# Altium project LL_project.PrjPcb
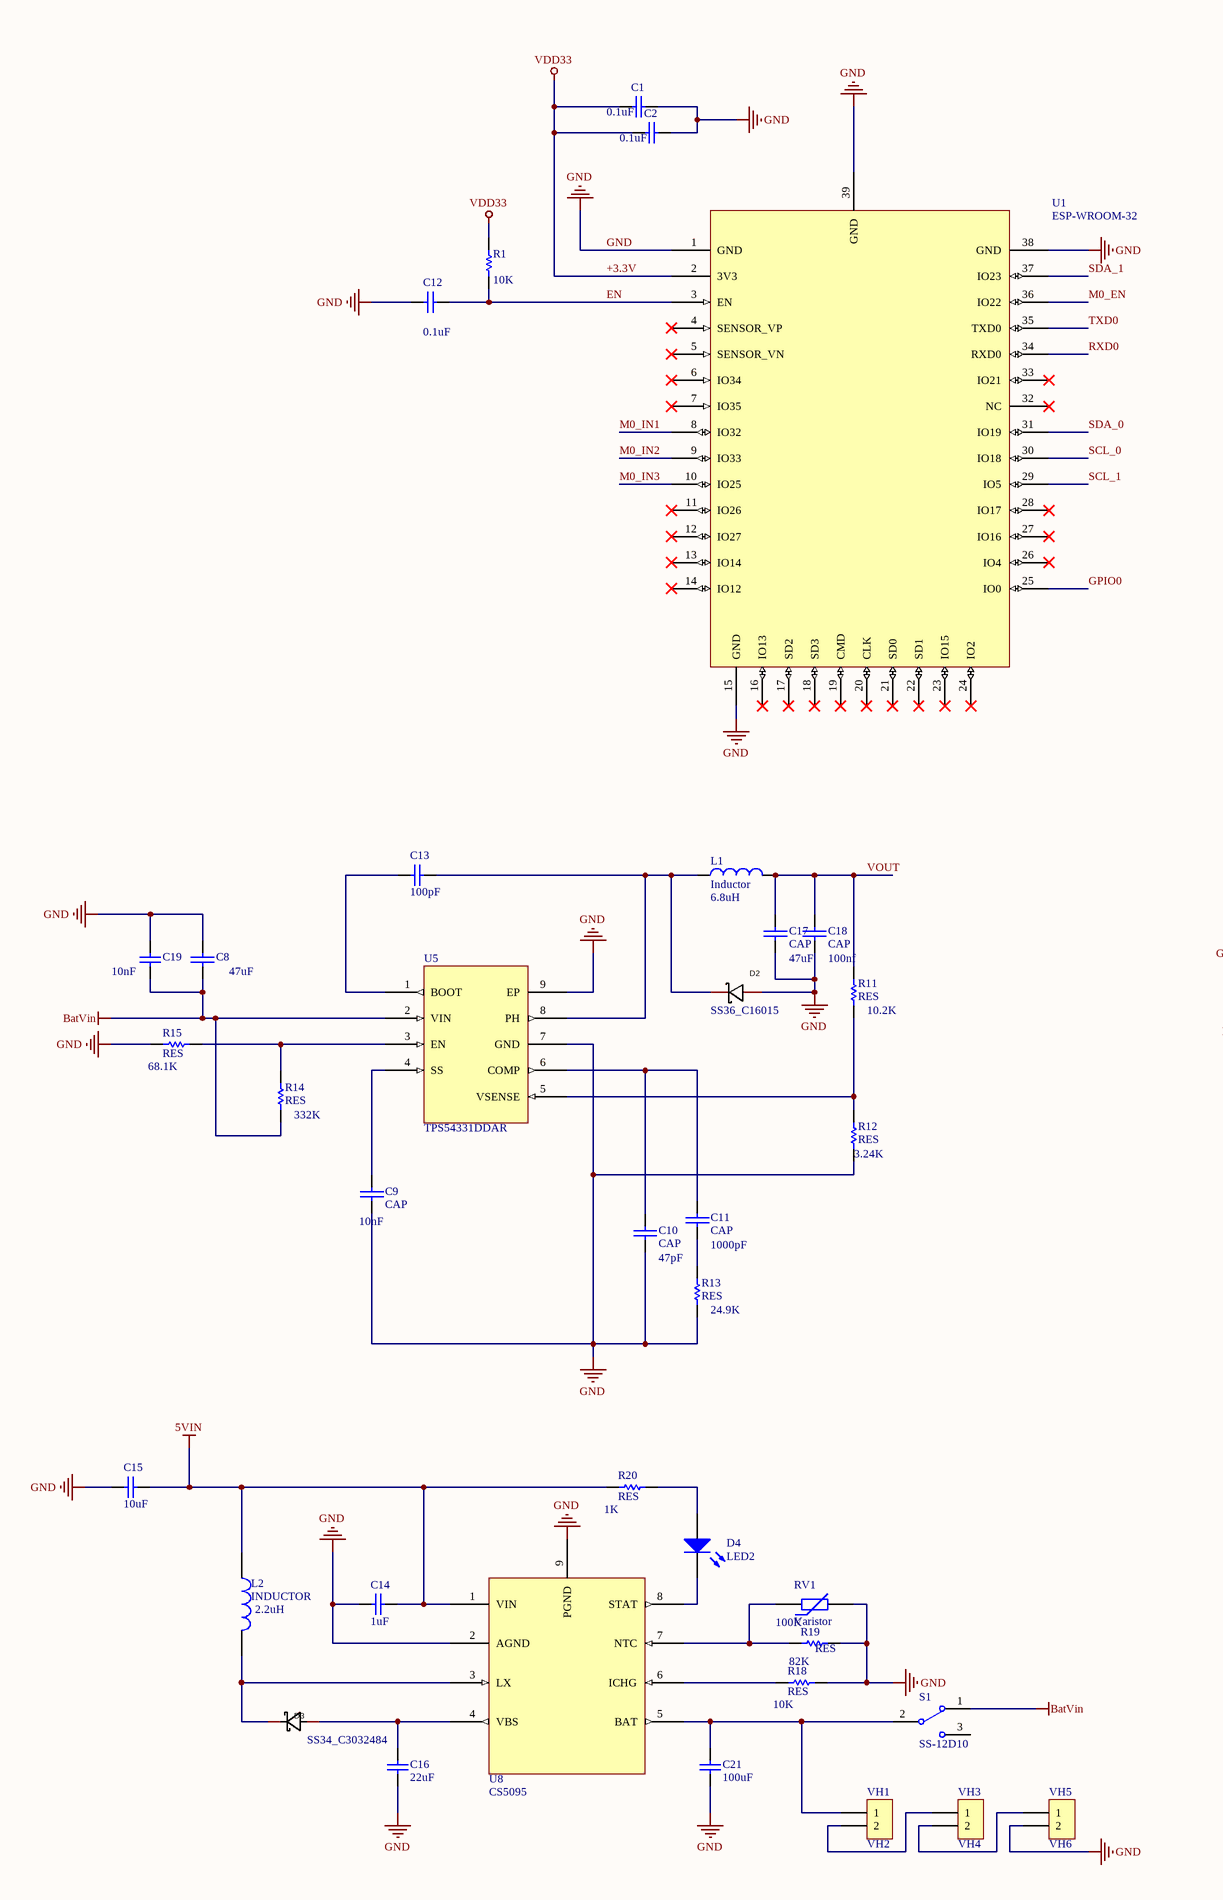
[diagram p0: LL_project.SchDoc, left]
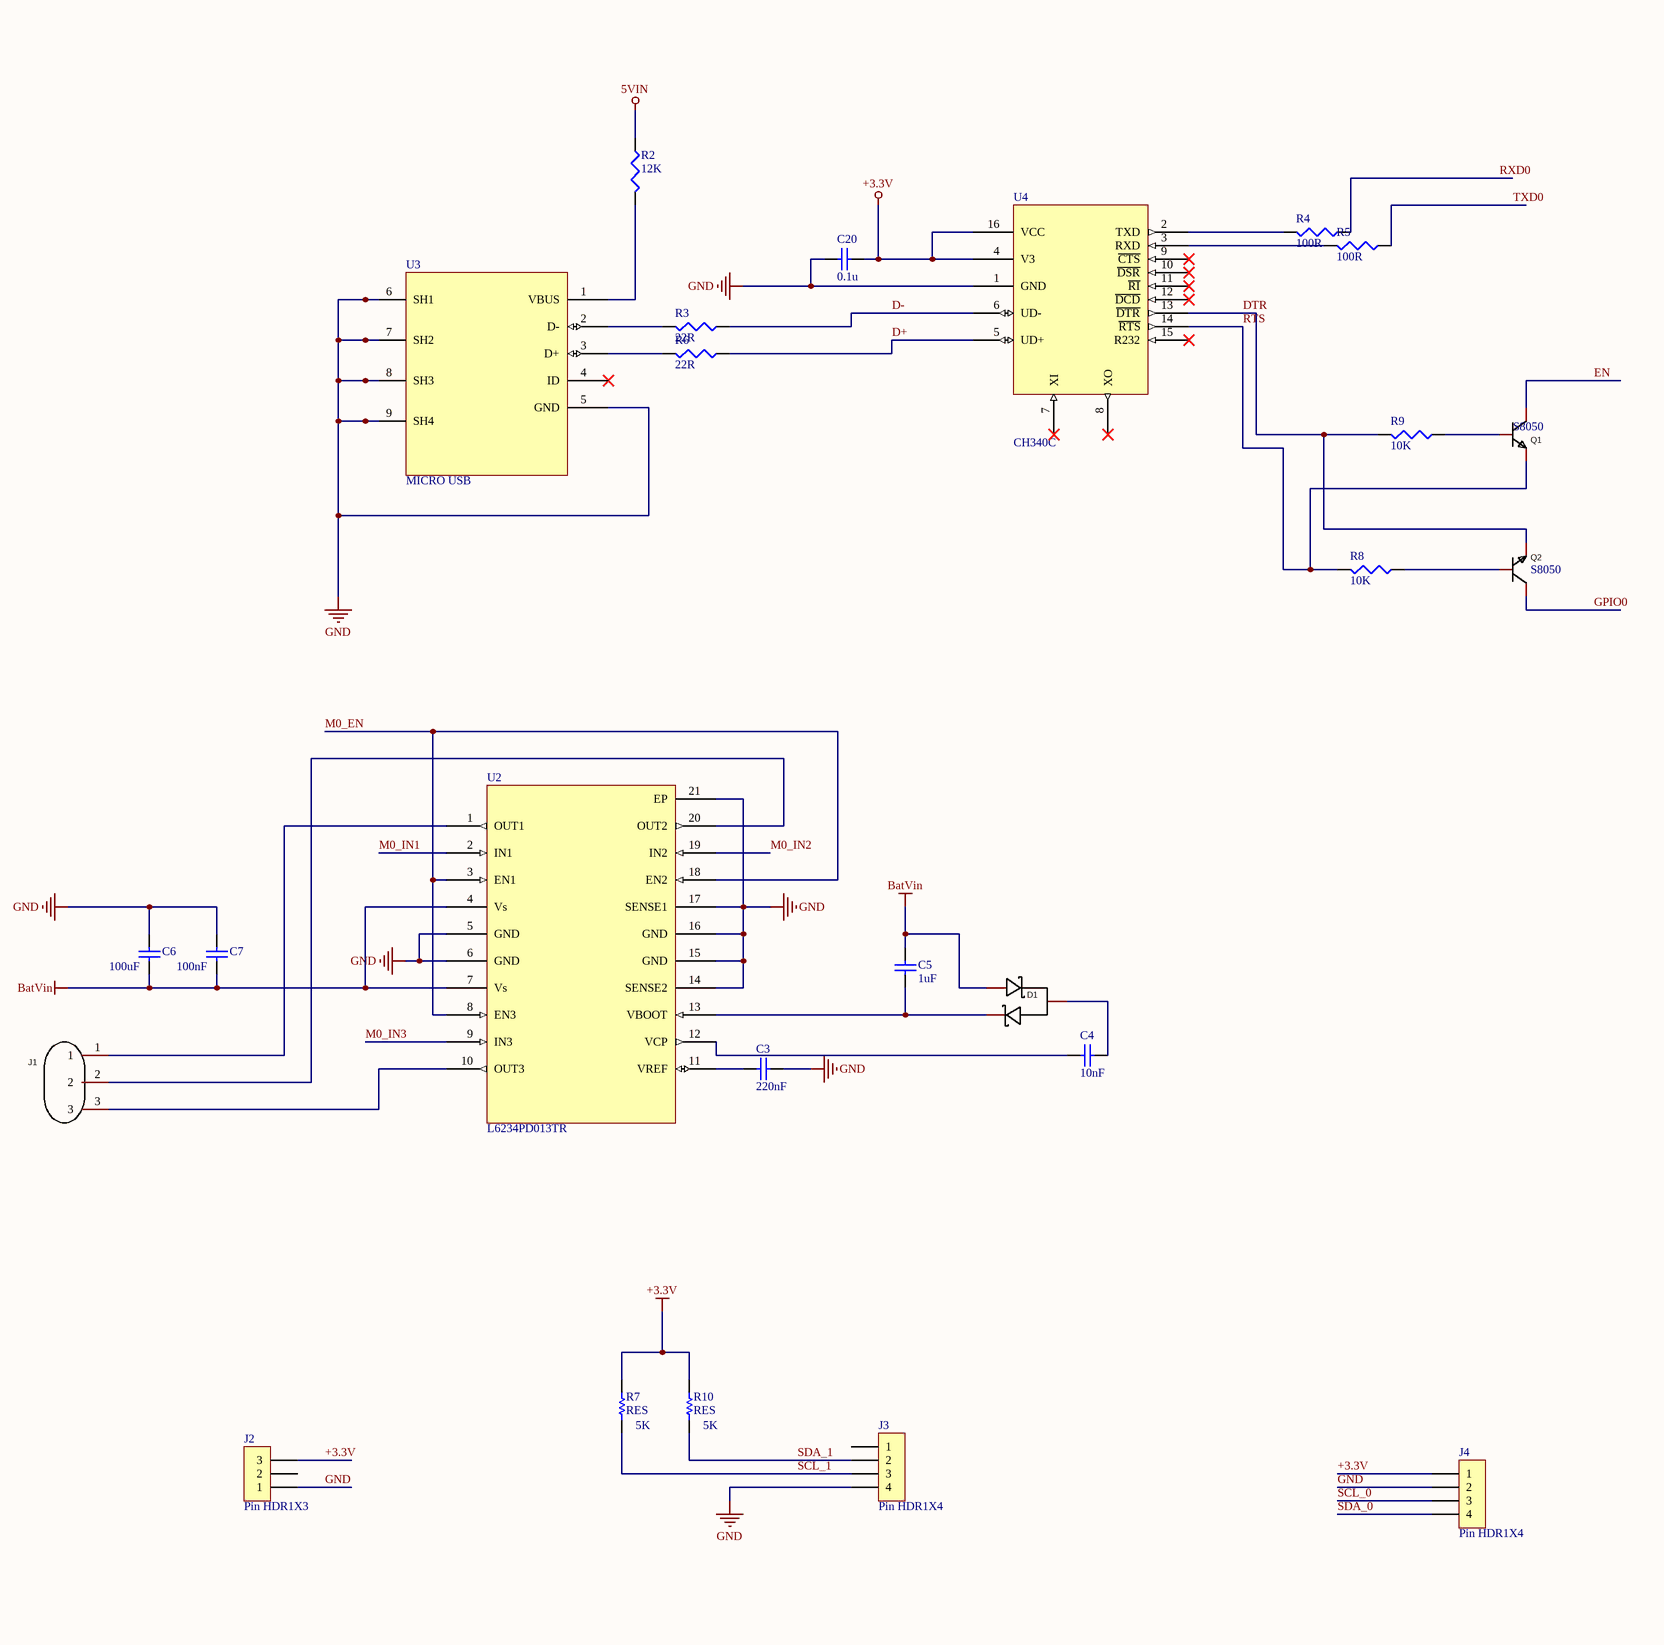
[diagram p1: LL_project.SchDoc, right]
1 sheet, 62 parts. Net scope: global (net labels, ports and power ports of the same name join across sheets).
Board file: LL_project.PcbDoc

## Sheet LL_project.SchDoc
size A2

### Parts
C1  value 0.1uF  [0603-1]  (hidden comment: Cap Semi)
C2  value 0.1uF  [0603-1]  (hidden comment: Cap Semi)
C3  value 220nF  [0603-1]  (hidden comment: Cap Semi)
C4  value 10nF  [0603-1]  (hidden comment: Cap Semi)
C5  value 1uF  [0603-1]  (hidden comment: Cap Semi)
C6  value 100uF  [0603-1]  (hidden comment: Cap Semi)
C7  value 100nF  [0603-1]  (hidden comment: Cap Semi)
C8  CAP  [0603-1]  (value not drawn)
C9  CAP  [0603-1]
C10  CAP  [0603-1]
C11  CAP  [0603-1]
C12  value 0.1uF  [0603-1]  (hidden comment: Cap Semi)
C13  value 100pF  [0603-1]  (hidden comment: Cap Semi)
C14  value 1uF  [0603-1]  (hidden comment: Cap Semi)
C15  value 10uF  [0603-1]  (hidden comment: Cap Semi)
C16  value 22uF  [0603-1]  (hidden comment: Cap Semi)
C17  CAP  [0603-1]
C18  CAP  [0603-1]
C19  value 10nF  [0603-1]  (hidden comment: Cap Semi)
C20  value 0.1u  [0603-1]  (hidden comment: Cap Semi)
C21  value 100uF  [0603-1]  (hidden comment: Cap Semi)
D1  LBAT54SLT1G  [schottky]  (value not drawn)
D2  SS36_C16015  [SMA_L4.3-W2.6-LS5.2-RD]
D3  SS34_C3032484  [SMA_L4.3-W2.6-LS5.2-RD]
D4  LED2  [LED_0603_R]
J1  WJ126V-5.0-3P  [CONN-TH_3P-P5.00_WJ126V-5.0-3P]  (value not drawn)
J2  Pin HDR1X3  [Pin HDR1X3/2.54mm-S]
J3  Pin HDR1X4  [Pin HDR1X4/2.54mm-S]
J4  Pin HDR1X4  [Pin HDR1X4/2.54mm-S]
L1  Inductor  value 6.8uH  [0805L]
L2  INDUCTOR  [0603L]
Q1  S8050  [Q1]
Q2  S8050  [Q1]
R1  value 10K  [0603-1]  (hidden comment: Res1)
R2  value 12K  [0805-1]  (hidden comment: Res3)
R3  value 22R  [0603-1]  (hidden comment: Res3)
R4  value 100R  [0603-1]  (hidden comment: Res3)
R5  value 100R  [0603-1]  (hidden comment: Res3)
R6  value 22R  [0603-1]  (hidden comment: Res3)
R7  RES  [0603-1]
R8  value 10K  [0603-1]  (hidden comment: Res3)
R9  value 10K  [0603-1]  (hidden comment: Res3)
R10  RES  [0603-1]
R11  RES  [0603-1]
R12  RES  [0603-1]
R13  RES  [0603-1]
R14  RES  [0603-1]
R15  RES  [0603-1]
R18  RES  [0603-1]
R19  RES  [0603-1]
R20  RES  [0603-1]
RV1  Varistor  [0603-1]
S1  SS-12D10  [SS-12D10]
U1  ESP-WROOM-32  [ESP32]
U2  L6234PD013TR  [L6234]
U3  MICRO USB  [MICRO-USB-SMD_MICROXNJ]
U4  CH340C  [SOP-16_L10.0-W3.9-P1.27-LS6.0-BL]
U5  TPS54331DDAR  [SOIC-8_L5.0-W4.0-P1.27-LS6.0-BL-EP2.0]
U8  CS5095  [cs5095]
VH1  VH2  [VH]
VH3  VH4  [VH]
VH5  VH6  [VH]

### Nets
5VIN: C14.2 C15.2 L2.1 R2.1 R20.2 U8.1(VIN)
+3.3V: C1.1 C2.1 C20.1 J2.3 J4.1 R1.2 R7.2 R10.2 U1.2(3V3) U4.4(V3) U4.16(VCC)  [also labelled VDD33]
BatVin: C5.1 C6.1 C7.1 C8.1 C19.1 D1.1(A) R14.1 S1.1 U2.4(Vs) U2.7(Vs) U5.2(VIN)
GND: C1.2 C2.2 C3.1 C6.2 C7.2 C8.2 C9.1 C10.1 C12.1 C14.1 C15.1 C16.1 C17.1 C18.1 C19.2 C20.2 C21.1 D2.2(A) J2.1 J3.4 J4.2 R12.1 R13.1 R15.2 R18.1 R19.1 RV1.2 U1.1(GND) U1.15(GND) U1.38(GND) U1.39(GND) U2.5(GND) U2.6(GND) U2.14(SENSE2) U2.15(GND) U2.16(GND) U2.17(SENSE1) U2.21(EP) U3.5(GND) U3.6(SH1) U3.7(SH2) U3.8(SH3) U3.9(SH4) U4.1(GND) U5.7(GND) U5.9(EP) U8.2(AGND) U8.9(PGND) VH5.2
D+: R6.1 U4.5(UD+)
D-: R3.1 U4.6(UD-)
DTR: Q2.2(E) R9.2 U4.13(~{DTR})
EN: C12.2 Q1.3(C) R1.1 U1.3(EN)
GPIO0: Q2.3(C) U1.25(IO0)
M0_EN: U1.36(IO22) U2.3(EN1) U2.8(EN3) U2.18(EN2)
M0_IN1: U1.8(IO32) U2.2(IN1)
M0_IN2: U1.9(IO33) U2.19(IN2)
M0_IN3: U1.10(IO25) U2.9(IN3)
RTS: Q1.2(E) R8.2 U4.14(~{RTS})
RXD0: R4.1 U1.34(RXD0)
SCL_0: J4.3 U1.30(IO18)
SCL_1: J3.3 R7.1 U1.29(IO5)
SDA_0: J4.4 U1.31(IO19)
SDA_1: J3.2 R10.1 U1.37(IO23)
TXD0: R5.1 U1.35(TXD0)
VOUT: C17.2 C18.2 L1.2 R11.2
NetC3_2: C3.2 U2.11(VREF)
NetC4_1: C4.1 D1.3(AK)
NetC4_2: C4.2 U2.12(VCP)
NetC5_2: C5.2 D1.2(K) U2.13(VBOOT)
NetC9_2: C9.2 U5.4(SS)
NetC10_2: C10.2 C11.2 U5.6(COMP)
NetC11_1: C11.1 R13.2
NetC13_1: C13.1 U5.1(BOOT)
NetC13_2: C13.2 D2.1(K) L1.1 U5.8(PH)
NetC16_2: C16.2 D3.2(A) U8.4(VBS)
NetC21_2: C21.2 S1.2 U8.5(BAT) VH1.1
NetD3_1: D3.1(K) L2.2 U8.3(LX)
NetD4_1: D4.1(A) R20.1
NetD4_2: D4.2(K) U8.8(STAT)
NetJ1_1: J1.1 U2.1(OUT1)
NetJ1_2: J1.2 U2.20(OUT2)
NetJ1_3: J1.3 U2.10(OUT3)
NetQ1_1: Q1.1(B) R9.1
NetQ2_1: Q2.1(B) R8.1
NetR2_2: R2.2 U3.1(VBUS)
NetR3_2: R3.2 U3.2(D-)
NetR4_2: R4.2 U4.2(TXD)
NetR5_2: R5.2 U4.3(RXD)
NetR6_2: R6.2 U3.3(D+)
NetR11_1: R11.1 R12.2 U5.5(VSENSE)
NetR14_2: R14.2 R15.1 U5.3(EN)
NetR18_2: R18.2 U8.6(ICHG)
NetR19_2: R19.2 RV1.1 U8.7(NTC)
NetVH1_2: VH1.2 VH3.1
NetVH3_2: VH3.2 VH5.1

Not connected (* = marked no-connect by the designer): J2 2; J3 1; S1 3; U1 4(SENSOR_VP)* 5(SENSOR_VN)* 6(IO34)* 7(IO35)* 11(IO26)* 12(IO27)* 13(IO14)* 14(IO12)* 16(IO13)* 17(SD2)* 18(SD3)* 19(CMD)* 20(CLK)* 21(SD0)* 22(SD1)* 23(IO15)* 24(IO2)* 26(IO4)* 27(IO16)* 28(IO17)* 32(NC)* 33(IO21)*; U3 4(ID)*; U4 7(XI)* 8(XO)* 9(~{CTS})* 10(~{DSR})* 11(~{RI})* 12(~{DCD})* 15(R232)*

### Notes on the sheet
- (in symbol CAP) 10nF; 47pF; 1000pF; 47uF; 100nf
- (in symbol INDUCTOR) 2.2uH
- (in symbol RES) 10.2K; 3.24K; 24.9K; 332K; 68.1K; 10K; 82K; 1K; 5K
- (in symbol Varistor) 100K

### Library data of the parts
C1-C7 C12-C16 C19-C21 = Cap Semi: Capacitor (Semiconductor SIM Model); Published: 8-Jun-2000; LatestRevisionDate: 29-May-2009; LatestRevisionNote: IPC-7351 Footprint Added.; PackageReference: C1206; Publisher: Altium Limited; PackageDescription: Chip Capacitor
C8-C11 C17 C18 = CAP: 无极性电容
D1 = LBAT54SLT1G: Manufacturer: LRC(乐山无线电); Add into BOM: yes; Reverse Voltage (Vr): 30V; Average Rectified Current (Io): 200mA; Forward Voltage (Vf@If): 320mV@1mA; Name: LBAT54SLT1G; Symbol: LBAT54SLT1G; Device: LBAT54SLT1G; LCSC Part Name: 30V 200mA 320mV@1mA; Supplier Part: C12765; Manufacturer Part: LBAT54SLT1G; Supplier Footprint: SOT-23(SOT-23-3); JLCPCB Part Class: Extended Part; Datasheet: https://atta.szlcsc.com/upload/public/pdf/source/20130604/1457706606553.pdf; Supplier: LCSC; Convert to PCB: yes
D2 = SS36_C16015: Manufacturer: MDD; Name: SS36; Add into BOM: yes; Reverse Voltage (Vr): 60V; Average Rectified Current (Io): 3A; Forward Voltage (Vf@If): 700mV@3A; Symbol: SS36; Device: SS36_C16015; LCSC Part Name: 60V 3A 700mV@3A; Supplier Part: C16015; Manufacturer Part: SS36; Supplier Footprint: SMA(DO-214AC); JLCPCB Part Class: Extended Part; Datasheet: https://atta.szlcsc.com/upload/public/pdf/source/20210506/C15874_5BDBC70F665BA444FCE0210303DB2A89.pdf; Supplier: LCSC; Convert to PCB: yes
D3 = SS34_C3032484: Manufacturer: TDD(台冠电子); Name: SS34; Add into BOM: yes; Symbol: SS34_C3032484; Device: SS34_C3032484; LCSC Part Name: SS34; Supplier Part: C3032484; Manufacturer Part: SS34; Supplier Footprint: SMA; JLCPCB Part Class: Extended Part; Datasheet: https://atta.szlcsc.com/upload/public/pdf/source/20220622/9D70D0693761B542BF6F533590093AA5.pdf; Supplier: LCSC; Convert to PCB: yes
D4 = LED2: Typical RED, GREEN, YELLOW, AMBER GaAs LED; Published: 8-Jun-2000; LatestRevisionDate: 17-Jul-2002; LatestRevisionNote: Re-released for DXP Platform.; PackageVersion: Feb-2002; PackageReference: 3.2X1.6X1.1; Publisher: Altium Limited; PackageDescription: SM LED; 2 Flat Leads
J1 = WJ126V-5.0-3P: Manufacturer: KANGNEX(康奈克斯电气); Add into BOM: yes; Pitch: 5mm; Number of PINs Per Row: 3; Mounting Sytle: 直针; Current Rating (Max): 18A; Voltage Rating (Max): 250V; Wire Gauge - AWG: 14~26; Wire Gauge - mm?: 2.5; Name: WJ126V-5.0-3P; Symbol: WJ126V-5.0-3P; Device: WJ126V-5.0-3P; LCSC Part Name: 5mm 排数:1 每排P数:3 直针 可拼接; Supplier Part: C8401; Manufacturer Part: WJ126V-5.0-3P; Supplier Footprint: P=5mm; JLCPCB Part Class: Extended Part; Datasheet: https://atta.szlcsc.com/upload/public/pdf/source/20191225/C8401_BC4AEF85CCBF7CDF5CCE64583ADD1E63.pdf; Supplier: LCSC; Convert to PCB: yes; Number of Rows: 1; Operating Temperature Range: -40℃~+105℃; Color: 绿色
L1 = Inductor: Code_IEC: 1005; Published: 8-Jun-2000; LatestRevisionDate: 29-May-2009; LatestRevisionNote: IPC-7351 Footprint Added.; PackageReference: 0402-A; Publisher: Altium Limited; PackageDescription: Chip Inductor; Code_JEITA: 0402
Q1 Q2 = S8050: Manufacturer: Doeshare(德芯); Symbol: S8050_C2931719; Add into BOM: yes; Name: S8050; Device: S8050; LCSC Part Name: S8050; Supplier Part: C2931719; Manufacturer Part: S8050; Supplier Footprint: SOT-23; JLCPCB Part Class: Extended Part; Datasheet: https://atta.szlcsc.com/upload/public/pdf/source/20220117/E6D3315E0D6ADDB25840BFFAC039C5C0.pdf; Supplier: LCSC; Convert to PCB: yes
R1 = Res1: Resistor; Published: 8-Jun-2000; LatestRevisionDate: 17-Jul-2002; LatestRevisionNote: Re-released for DXP Platform.; PackageReference: AXIAL-0.3; Publisher: Altium Limited; PackageDescription: Axial Device, Thru-Hole; 2 Leads; 0.3 in Pin Spacing
R2-R6 R8 R9 = Res3: Resistor; Published: 8-Jun-2000; LatestRevisionDate: 29-May-2009; LatestRevisionNote: IPC-7351 Footprint Added.; PackageReference: J1-0603; Publisher: Altium Limited; PackageDescription: Chip Resistor
RV1 = Varistor: 压敏电阻
VH3 VH5 = VH2